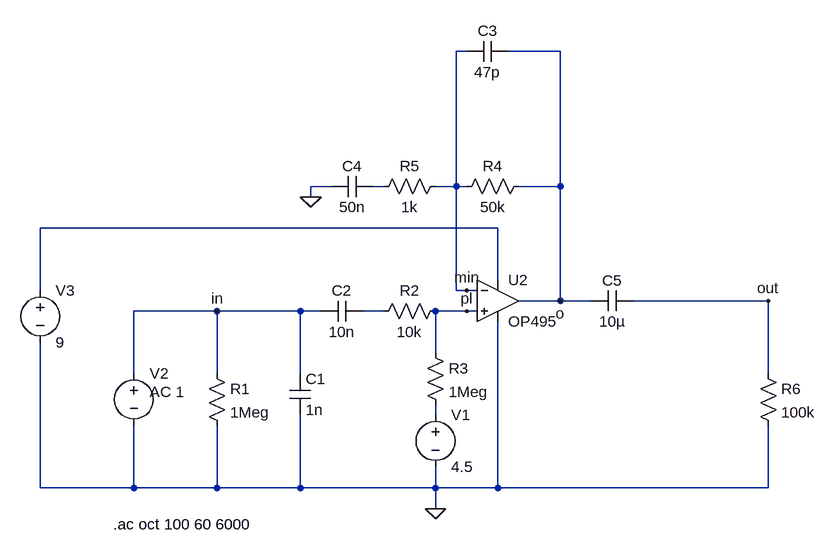
[diagram p0: schematic generalguitargadgets.asc]
generalguitargadgets.asc, the LTspice schematic file:
Version 4
SHEET 1 880 680
WIRE 224 -528 208 -528
WIRE 368 -528 288 -528
WIRE 16 -320 -16 -320
WIRE 96 -320 80 -320
WIRE 208 -320 208 -528
WIRE 208 -320 176 -320
WIRE 224 -320 208 -320
WIRE 368 -320 368 -528
WIRE 368 -320 304 -320
WIRE -16 -304 -16 -320
WIRE 272 -256 -432 -256
WIRE 272 -176 272 -256
WIRE -432 -160 -432 -256
WIRE 208 -160 208 -320
WIRE 224 -160 208 -160
WIRE 240 -160 224 -160
WIRE 368 -144 368 -320
WIRE 368 -144 304 -144
WIRE 416 -144 368 -144
WIRE 688 -144 480 -144
WIRE -160 -128 -288 -128
WIRE -32 -128 -160 -128
WIRE 0 -128 -32 -128
WIRE 96 -128 64 -128
WIRE 224 -128 176 -128
WIRE 240 -128 224 -128
WIRE 176 -64 176 -128
WIRE -288 -32 -288 -128
WIRE -160 -32 -160 -128
WIRE -32 -32 -32 -128
WIRE 688 -32 688 -144
WIRE 176 32 176 16
WIRE -432 144 -432 -80
WIRE -288 144 -288 48
WIRE -288 144 -432 144
WIRE -160 144 -160 48
WIRE -160 144 -288 144
WIRE -32 144 -32 32
WIRE -32 144 -160 144
WIRE 176 144 176 112
WIRE 176 144 -32 144
WIRE 272 144 272 -112
WIRE 272 144 176 144
WIRE 688 144 688 48
WIRE 688 144 272 144
WIRE 176 176 176 144
FLAG 176 176 0
FLAG -16 -304 0
FLAG 368 -144 o
FLAG -160 -128 in
FLAG 688 -144 out
FLAG 224 -128 pl
FLAG 224 -160 min
SYMBOL res -176 -48 R0
SYMATTR InstName R1
SYMATTR Value 1Meg
SYMBOL cap -48 -32 R0
SYMATTR InstName C1
SYMATTR Value 1n
SYMBOL res 160 -80 R0
SYMATTR InstName R3
SYMATTR Value 1Meg
SYMBOL res 192 -144 R90
WINDOW 0 0 56 VBottom 2
WINDOW 3 32 56 VTop 2
SYMATTR InstName R2
SYMATTR Value 10k
SYMBOL cap 64 -144 R90
WINDOW 0 0 32 VBottom 2
WINDOW 3 32 32 VTop 2
SYMATTR InstName C2
SYMATTR Value 10n
SYMBOL res 320 -336 R90
WINDOW 0 0 56 VBottom 2
WINDOW 3 32 56 VTop 2
SYMATTR InstName R4
SYMATTR Value 50k
SYMBOL res 192 -336 R90
WINDOW 0 0 56 VBottom 2
WINDOW 3 32 56 VTop 2
SYMATTR InstName R5
SYMATTR Value 1k
SYMBOL cap 288 -544 R90
WINDOW 0 0 32 VBottom 2
WINDOW 3 32 32 VTop 2
SYMATTR InstName C3
SYMATTR Value 47p
SYMBOL cap 80 -336 R90
WINDOW 0 0 32 VBottom 2
WINDOW 3 32 32 VTop 2
SYMATTR InstName C4
SYMATTR Value 50n
SYMBOL voltage 176 16 R0
WINDOW 123 0 0 Left 0
WINDOW 39 0 0 Left 0
SYMATTR InstName V1
SYMATTR Value 4.5
SYMBOL voltage -288 -48 R0
WINDOW 3 24 44 Left 2
WINDOW 123 24 44 Left 2
WINDOW 39 0 0 Left 0
SYMATTR Value ""
SYMATTR Value2 AC 1
SYMATTR InstName V2
SYMBOL OpAmps\\OP495 272 -208 R0
SYMATTR InstName U2
SYMBOL voltage -432 -176 R0
WINDOW 123 0 0 Left 0
WINDOW 39 0 0 Left 0
SYMATTR InstName V3
SYMATTR Value 9
SYMBOL cap 480 -160 R90
WINDOW 0 0 32 VBottom 2
WINDOW 3 32 32 VTop 2
SYMATTR InstName C5
SYMATTR Value 10µ
SYMBOL res 672 -48 R0
SYMATTR InstName R6
SYMATTR Value 100k
TEXT -320 200 Left 2 !.ac oct 100 60 6000

The netlist it stands for:
* generalguitargadgets.asc
R1 in 0 1Meg
C1 in 0 1n
R3 pl N004 1Meg
R2 pl N003 10k
C2 N003 in 10n
R4 o min 50k
R5 min N001 1k
C3 o min 47p
C4 N001 0 50n
V1 N004 0 4.5
V2 in 0 AC 1
XU2 pl min N002 0 o OP495  ; pins In+ In- V+ V- OUT
V3 N002 0 9
C5 out o 10µ
R6 out 0 100k
.ac oct 100 60 6000
.backanno
.end